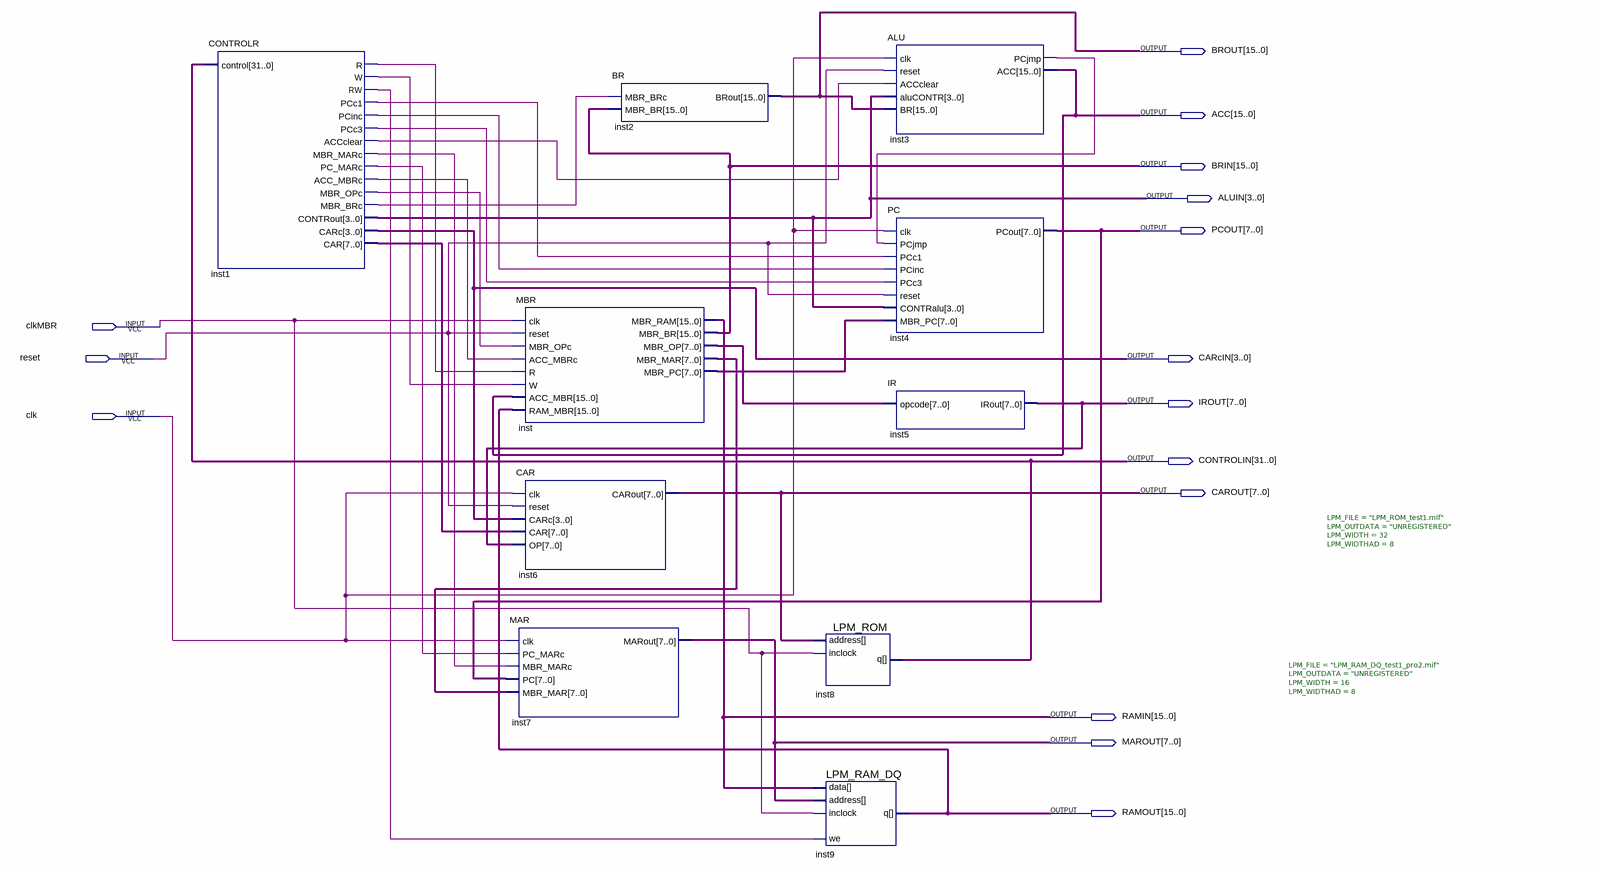
[diagram p0: schematic sheet]
// Quartus schematic top_level.bdf as structural Verilog: 10 symbols, 15 pins
module top_level (
  input  clkMBR,
  input  reset,
  input  clk,
  output [15:0] BROUT,
  output [15:0] ACC,
  output [15:0] BRIN,
  output [3:0] ALUIN,
  output [7:0] PCOUT,
  output [3:0] CARcIN,
  output [7:0] IROUT,
  output [31:0] CONTROLIN,
  output [7:0] CAROUT,
  output [15:0] RAMIN,
  output [7:0] MAROUT,
  output [15:0] RAMOUT
);

  wire inst1_acc_mbrc, inst1_accclear, inst1_mbr_brc, inst1_mbr_marc, inst1_mbr_opc, inst1_pc_marc,
       inst1_pcc1, inst1_pcc3, inst1_pcinc, inst1_r, inst1_rw, inst1_w, inst3_pcjmp;
  wire [7:0] inst1_car, inst_mbr_mar, inst_mbr_op, inst_mbr_pc;

  CONTROLR inst1 (
    .control(CONTROLIN), .R(inst1_r), .W(inst1_w), .RW(inst1_rw), .PCc1(inst1_pcc1), .PCinc(inst1_pcinc),
    .PCc3(inst1_pcc3), .ACCclear(inst1_accclear), .MBR_MARc(inst1_mbr_marc), .PC_MARc(inst1_pc_marc),
    .ACC_MBRc(inst1_acc_mbrc), .MBR_OPc(inst1_mbr_opc), .MBR_BRc(inst1_mbr_brc), .CONTRout(ALUIN),
    .CARc(CARcIN), .CAR(inst1_car));
  MBR inst (
    .clk(clkMBR), .reset(reset), .MBR_OPc(inst1_mbr_opc), .ACC_MBRc(inst1_acc_mbrc), .R(inst1_r),
    .W(inst1_w), .ACC_MBR(ACC), .RAM_MBR(RAMOUT), .MBR_RAM(RAMIN), .MBR_BR(BRIN), .MBR_OP(inst_mbr_op),
    .MBR_MAR(inst_mbr_mar), .MBR_PC(inst_mbr_pc));
  CAR inst6 (.clk(clk), .reset(reset), .CARc(CARcIN), .CAR(inst1_car), .OP(IROUT), .CARout(CAROUT));
  MAR inst7 (
    .clk(clk), .PC_MARc(inst1_pc_marc), .MBR_MARc(inst1_mbr_marc), .PC(PCOUT), .MBR_MAR(inst_mbr_mar),
    .MARout(MAROUT));
  BR inst2 (.MBR_BRc(inst1_mbr_brc), .MBR_BR(BRIN), .BRout(BROUT));
  LPM_ROM #(.LPM_FILE("LPM_ROM_test1.mif"), .LPM_OUTDATA("UNREGISTERED"), .LPM_WIDTH(32), .LPM_WIDTHAD(8)) inst8 (
    .address(CAROUT), .inclock(clkMBR), .q(CONTROLIN));
  LPM_RAM_DQ #(.LPM_FILE("LPM_RAM_DQ_test1_pro2.mif"), .LPM_OUTDATA("UNREGISTERED"), .LPM_WIDTH(16), .LPM_WIDTHAD(8)) inst9 (
    .inclock(clkMBR), .data(RAMIN), .address(MAROUT), .we(inst1_rw), .q(RAMOUT));
  ALU inst3 (
    .clk(clk), .reset(reset), .ACCclear(inst1_accclear), .aluCONTR(ALUIN), .BR(BROUT), .PCjmp(inst3_pcjmp),
    .ACC(ACC));
  PC inst4 (
    .clk(clk), .PCjmp(inst3_pcjmp), .PCc1(inst1_pcc1), .PCinc(inst1_pcinc), .PCc3(inst1_pcc3), .reset(reset),
    .CONTRalu(ALUIN), .MBR_PC(inst_mbr_pc), .PCout(PCOUT));
  IR inst5 (.opcode(inst_mbr_op), .IRout(IROUT));
endmodule
